# Altium schematic sheet Struct.SchDoc
size 420 x 297 mm; DocumentNumber: АБВГ.123456.XXX Э3; SheetNumber: 1; SheetTotal: 4; Title1str: УМС ЭЗАН; PageSetup: Record=PageOptionsZCenterHorizontal=FalseZCenterVertical=FalseZPrintScale=0.95ZXCorrection=0.00ZYCorrection=0.00ZPrintKind=1ZBorderSize=5000000ZLeftOffset=0ZBottomOffset=0ZOrientation=1ZPaperLength=1000ZPaperWidth=1000ZScale=100ZPaperSource=15ZPrintQuality=600ZMediaType=1ZDitherType=10ZPaperKind=A4ZPrintScaleMode=1; Title2str: (унифицированный модуль связи); Letter1Column: Р; DocumentType1str: Схема электрическая; DocumentType2str: принципиальная; DocumentCode: АБВГ.123456.XXX Э3
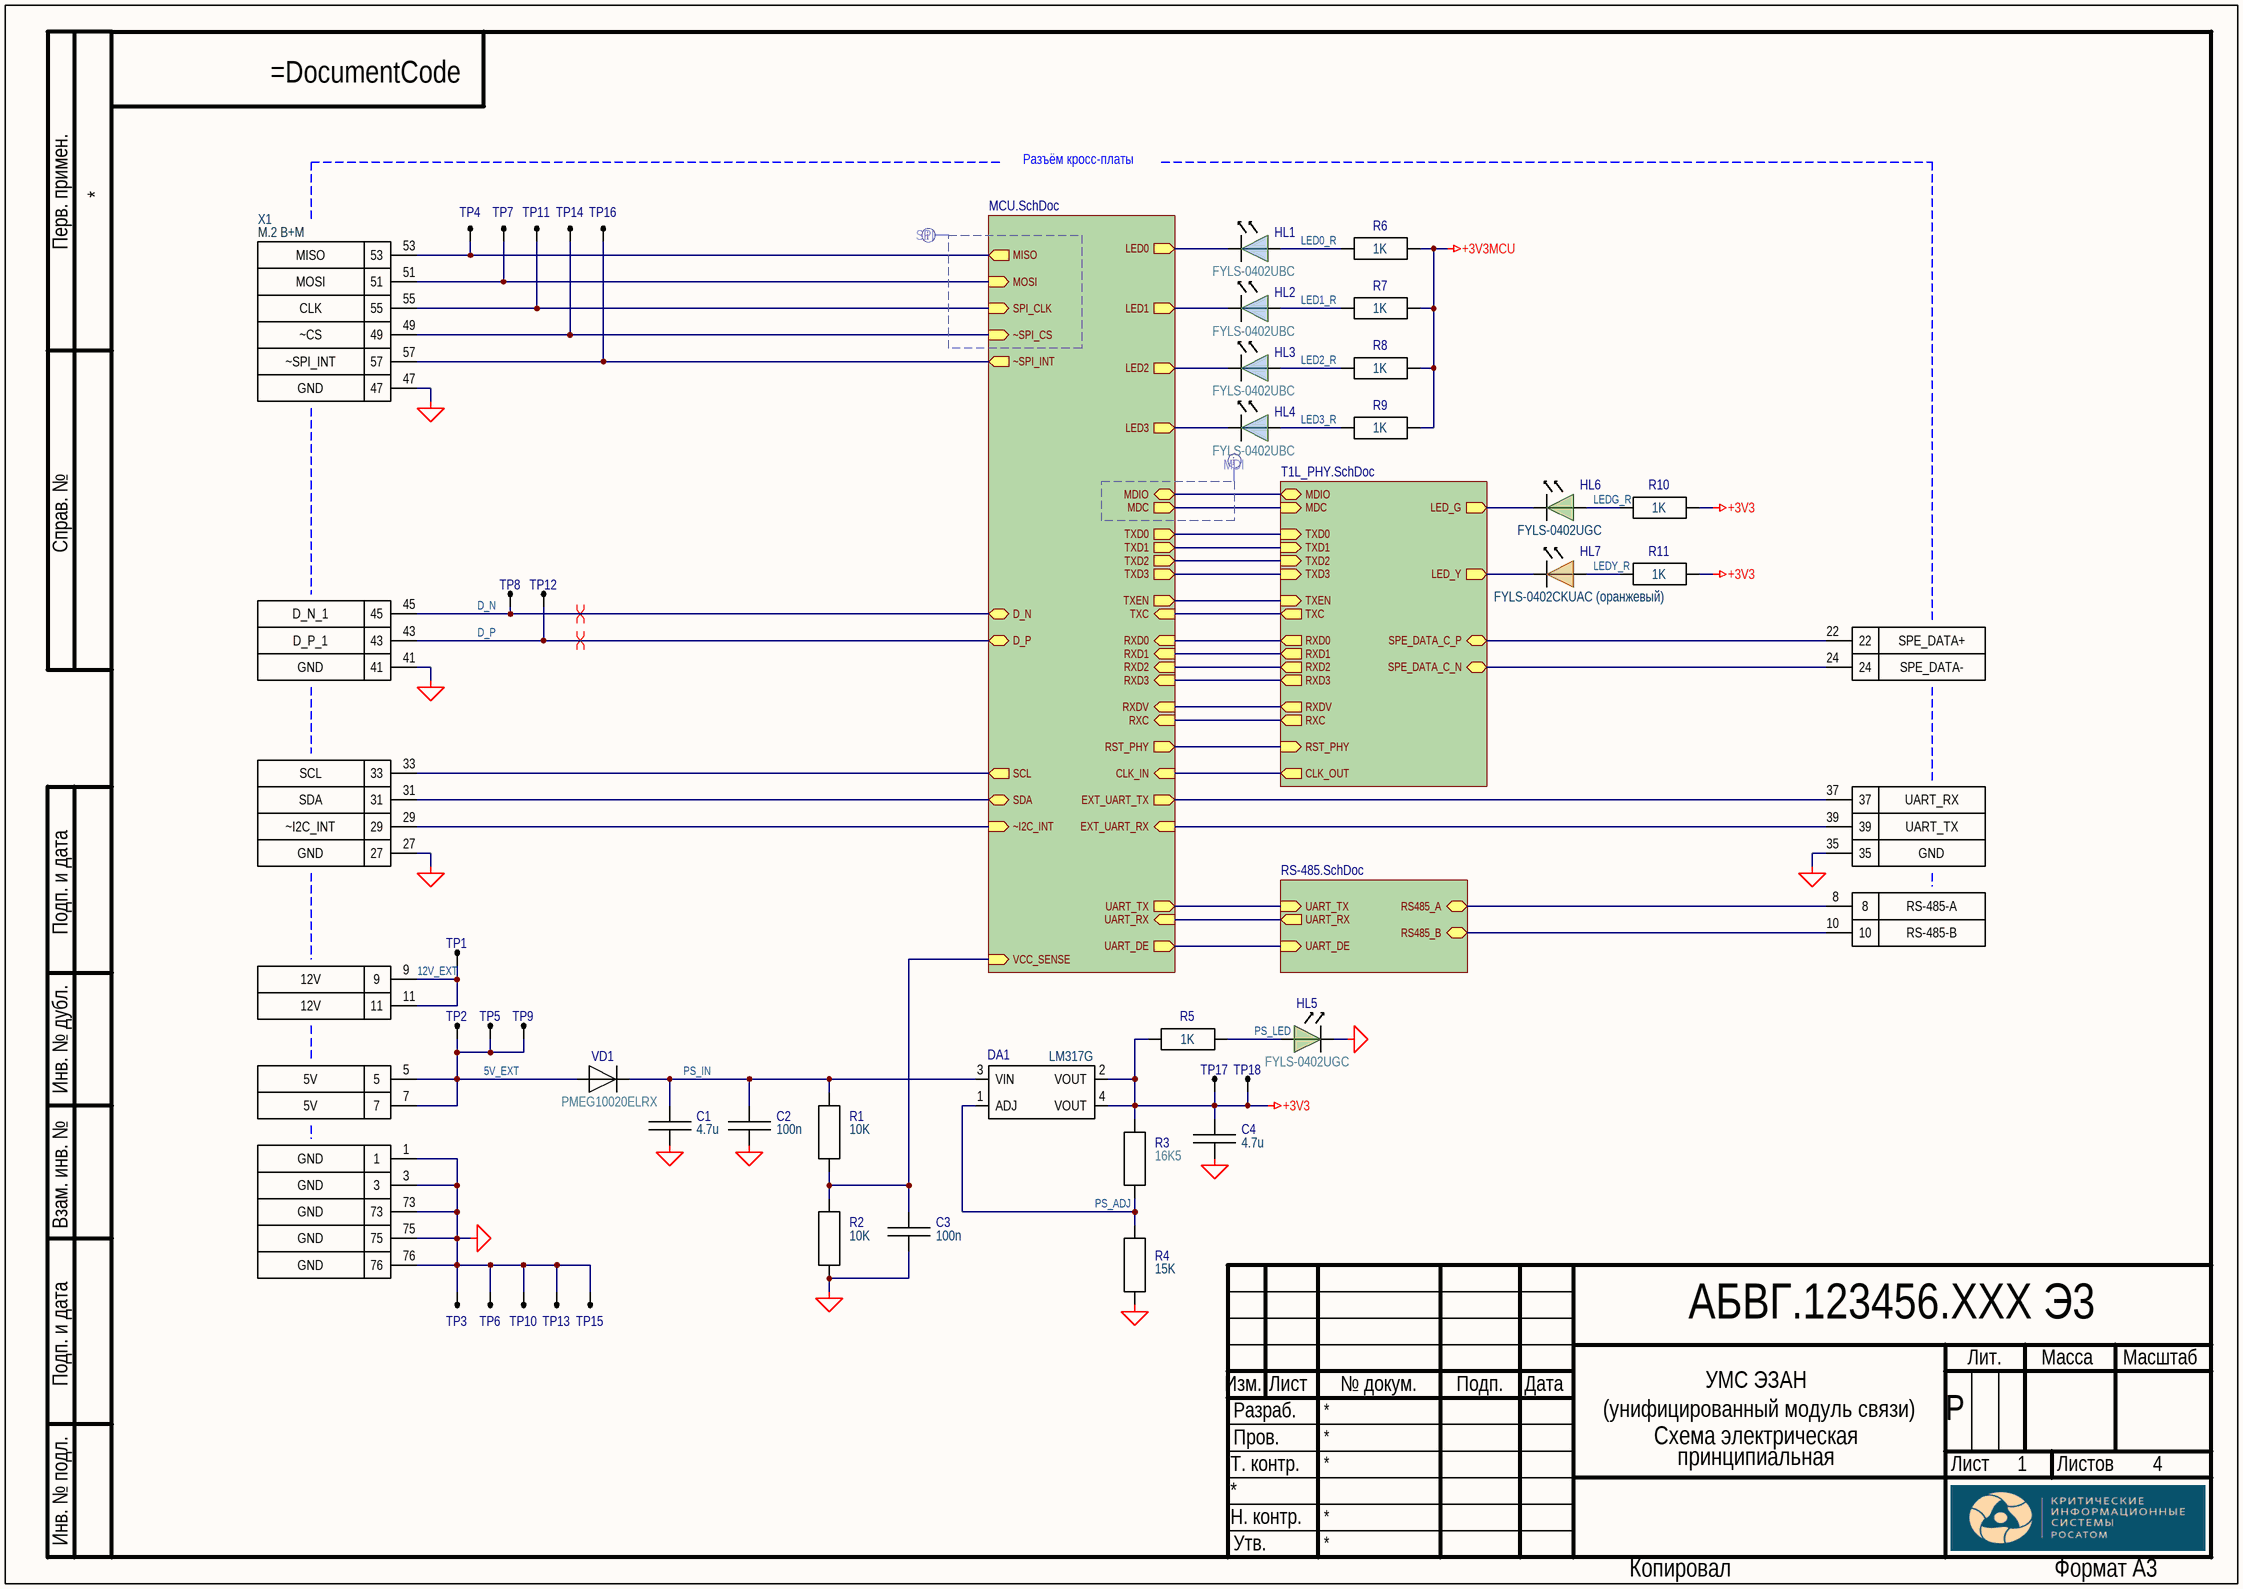
[diagram p0: Struct.SchDoc]

## Parts
C1  4.7u  [C0603]
C2  100n  [C0402]
C3  100n  [C0402]
C4  4.7u  [C0603]
DA1  LM317G  [SOT-223]
HL1  FYLS-0402UBC  [LED_SMD_0402_blue]
HL2  FYLS-0402UBC  [LED_SMD_0402_blue]
HL3  FYLS-0402UBC  [LED_SMD_0402_blue]
HL4  FYLS-0402UBC  [LED_SMD_0402_blue]
HL5  FYLS-0402UGC  [LED_SMD_0402]
HL6  FYLS-0402UGC  [LED_SMD_0402]
HL7  FYLS-0402CKUAC (оранжевый)  [LED_SMD_0402_orange]
R1  10K  [R0402]
R2  10K  [R0402]
R3  16K5  [R0603]
R4  15K  [R0603]
R5  1K  [R0402]
R6  1K  [R0402]
R7  1K  [R0402]
R8  1K  [R0402]
R9  1K  [R0402]
R10  1K  [R0402]
R11  1K  [R0402]
TP1  TEST_POINT_SMD  [TEST_POINT_SMD]  (value not drawn)  (no BOM)
TP2  TEST_POINT_SMD  [TEST_POINT_SMD]  (value not drawn)  (no BOM)
TP3  TEST_POINT_1.27_STEP  [TEST_POINT_1.27_STEP]  (value not drawn)  (no BOM)
TP4  TEST_POINT_1.27_STEP  [TEST_POINT_1.27_STEP]  (value not drawn)  (no BOM)
TP5  TEST_POINT_1.27_STEP  [TEST_POINT_1.27_STEP]  (value not drawn)  (no BOM)
TP6  TEST_POINT_1.27_STEP  [TEST_POINT_1.27_STEP]  (value not drawn)  (no BOM)
TP7  TEST_POINT_1.27_STEP  [TEST_POINT_1.27_STEP]  (value not drawn)  (no BOM)
TP8  TEST_POINT_1.27_STEP  [TEST_POINT_1.27_STEP]  (value not drawn)  (no BOM)
TP9  TEST_POINT_1.27_STEP  [TEST_POINT_1.27_STEP]  (value not drawn)  (no BOM)
TP10  TEST_POINT_SMD  [TEST_POINT_SMD]  (value not drawn)  (no BOM)
TP11  TEST_POINT_1.27_STEP  [TEST_POINT_1.27_STEP]  (value not drawn)  (no BOM)
TP12  TEST_POINT_1.27_STEP  [TEST_POINT_1.27_STEP]  (value not drawn)  (no BOM)
TP13  TEST_POINT_1.27_STEP  [TEST_POINT_1.27_STEP]  (value not drawn)  (no BOM)
TP14  TEST_POINT_1.27_STEP  [TEST_POINT_1.27_STEP]  (value not drawn)  (no BOM)
TP15  TEST_POINT_1.27_STEP  [TEST_POINT_1.27_STEP]  (value not drawn)  (no BOM)
TP16  TEST_POINT_1.27_STEP  [TEST_POINT_1.27_STEP]  (value not drawn)  (no BOM)
TP17  TEST_POINT_1.27_STEP  [TEST_POINT_1.27_STEP]  (value not drawn)  (no BOM)
TP18  TEST_POINT_1.27_STEP  [TEST_POINT_1.27_STEP]  (value not drawn)  (no BOM)
VD1  PMEG10020ELRX  [SOD123W]
X1  M2_3030_M_Partial  [m2-3030-B+M]  (value not drawn)  (parts A,B,C,D,E,F,G,H,I,J,K,L,M,N,O,P,Q,R,S,T,U,V,W,X,Y,Z,27,28,29 of 29)

## Sub-sheets
MCU = MCU.SchDoc: VCC_SENSE (in), MDIO (bidir), MDC (out), RST_PHY (out), TXEN (out), TXC (in), RXDV (in), RXC (in), RXD0 (in), RXD1 (in), RXD2 (in), RXD3 (in), TXD0 (out), TXD1 (out), TXD2 (out), TXD3 (out), LED0 (out), LED3 (out), UART_TX (out), UART_RX (in), UART_DE (out), MISO (out), MOSI (in), SPI_CLK (in), ~SPI_CS (in), ~SPI_INT (out), D_N (bidir), D_P (bidir), LED1 (out), LED2 (out), CLK_IN (in), EXT_UART_TX (out), EXT_UART_RX (in), SDA (bidir), SCL (out), ~I2C_INT (in)
RS-485 = RS-485.SchDoc: RS485_A (bidir), RS485_B (bidir), UART_TX (in), UART_RX (out), UART_DE (in)
T1L = T1L_PHY.SchDoc: RST_PHY (in), LED_G (out), LED_Y (out), MDIO (bidir), MDC (in), TXEN (in), TXC (out), RXDV (out), RXC (out), SPE_DATA_C_P (bidir), SPE_DATA_C_N (bidir), RXD0 (out), RXD1 (out), RXD2 (out), RXD3 (out), TXD0 (in), TXD1 (in), TXD2 (in), TXD3 (in), CLK_OUT (out)

## Nets
+3V3: C4.1 DA1.2(VOUT) DA1.4(VOUT) R3.2 R5.1 R10.2 R11.2 TP17.1 TP18.1
+3V3MCU: R6.2 R7.2 R8.2 R9.2
GND: C1.2 C2.1 C3.1 C4.2 HL5.2 R2.1 R4.1 TP3.1 TP6.1 TP10.1 TP13.1 TP15.1 X1.1 X1.3 X1.27 X1.35 X1.41 X1.47 X1.73 X1.75 X1.76
5V_EXT: TP2.1 TP5.1 TP9.1 VD1.2 X1.5 X1.7
12V_EXT: TP1.1 X1.9 X1.11
D_N: TP8.1 X1.45 ; sheet MCU/D_N
D_P: TP12.1 X1.43 ; sheet MCU/D_P
LED0_R: HL1.1 R6.1
LED1_R: HL2.1 R7.1
LED2_R: HL3.1 R8.1
LED3_R: HL4.1 R9.1
LEDG_R: HL6.1 R10.1
LEDY_R: HL7.1 R11.1
PS_ADJ: DA1.1(ADJ) R3.1 R4.2
PS_IN: C1.1 C2.2 DA1.3(VIN) R1.2 VD1.1
PS_LED: HL5.1 R5.2
NetC3_2: C3.2 R1.1 R2.2 ; sheet MCU/VCC_SENSE
NetHL1_2: HL1.2 ; sheet MCU/LED0
NetHL2_2: HL2.2 ; sheet MCU/LED1
NetHL3_2: HL3.2 ; sheet MCU/LED2
NetHL4_2: HL4.2 ; sheet MCU/LED3
NetHL6_2: HL6.2 ; sheet T1L/LED_G
NetHL7_2: HL7.2 ; sheet T1L/LED_Y
NetTP4_1: TP4.1 X1.53 ; sheet MCU/MISO
NetTP7_1: TP7.1 X1.51 ; sheet MCU/MOSI
NetTP11_1: TP11.1 X1.55 ; sheet MCU/SPI_CLK
NetTP14_1: TP14.1 X1.49 ; sheet MCU/~SPI_CS
NetTP16_1: TP16.1 X1.57 ; sheet MCU/~SPI_INT
NetX1_8: X1.8 ; sheet RS-485/RS485_A
NetX1_10: X1.10 ; sheet RS-485/RS485_B
NetX1_22: X1.22 ; sheet T1L/SPE_DATA_C_P
NetX1_24: X1.24 ; sheet T1L/SPE_DATA_C_N
NetX1_29: X1.29 ; sheet MCU/~I2C_INT
NetX1_31: X1.31 ; sheet MCU/SDA
NetX1_33: X1.33 ; sheet MCU/SCL
NetX1_37: X1.37 ; sheet MCU/EXT_UART_TX
NetX1_39: X1.39 ; sheet MCU/EXT_UART_RX
(unnamed): sheet T1L/RST_PHY, sheet MCU/RST_PHY
(unnamed): sheet T1L/MDIO, sheet MCU/MDIO
(unnamed): sheet T1L/MDC, sheet MCU/MDC
(unnamed): sheet T1L/TXEN, sheet MCU/TXEN
(unnamed): sheet T1L/TXC, sheet MCU/TXC
(unnamed): sheet T1L/RXDV, sheet MCU/RXDV
(unnamed): sheet T1L/RXC, sheet MCU/RXC
(unnamed): sheet T1L/RXD0, sheet MCU/RXD0
(unnamed): sheet T1L/RXD1, sheet MCU/RXD1
(unnamed): sheet T1L/RXD2, sheet MCU/RXD2
(unnamed): sheet T1L/RXD3, sheet MCU/RXD3
(unnamed): sheet T1L/TXD0, sheet MCU/TXD0
(unnamed): sheet T1L/TXD1, sheet MCU/TXD1
(unnamed): sheet T1L/TXD2, sheet MCU/TXD2
(unnamed): sheet T1L/TXD3, sheet MCU/TXD3
(unnamed): sheet T1L/CLK_OUT, sheet MCU/CLK_IN
(unnamed): sheet RS-485/UART_TX, sheet MCU/UART_TX
(unnamed): sheet RS-485/UART_RX, sheet MCU/UART_RX
(unnamed): sheet RS-485/UART_DE, sheet MCU/UART_DE

## Layout directives
differential pair: D_N, D_P
net class SPI: (no net found under the mark)
net class MDI: (no net found under the mark)

## Notes on the sheet
- Разъём кросс-платы
- X1
- M.2 B+M
- Labels drawn without touching a wire or pin: =DocumentCode
- Перв. примен.
- Справ. №
- Подп. и дата
- Инв. № дубл.
- Взам. инв. №
- Изм.
- Лист
- № докум.
- Подп.
- Дата
- Лит.
- Масса
- Масштаб
- Т. контр.
- Пров.
- Разраб.
- Листов
- Инв. № подл.
- Н. контр.
- Утв.
- Копировал
- Формат А3
- (in symbol M2_3030_B+M_Partial, part A) GND
- (in symbol M2_3030_B+M_Partial, part B) RS-485-B
- (in symbol M2_3030_B+M_Partial, part C) GND
- (in symbol M2_3030_B+M_Partial, part D) RS-485-A
- (in symbol M2_3030_B+M_Partial, part E) 5V
- (in symbol M2_3030_B+M_Partial, part F) 5V
- (in symbol M2_3030_B+M_Partial, part G) 12V
- (in symbol M2_3030_B+M_Partial, part H) 12V
- (in symbol M2_3030_B+M_Partial, part I) SPE_DATA+
- (in symbol M2_3030_B+M_Partial, part J) SPE_DATA-
- (in symbol M2_3030_B+M_Partial, part K) GND
- (in symbol M2_3030_B+M_Partial, part L) D_P_1
- (in symbol M2_3030_B+M_Partial, part M) D_N_1
- (in symbol M2_3030_B+M_Partial, part N) GND
- (in symbol M2_3030_B+M_Partial, part O) ~CS
- (in symbol M2_3030_B+M_Partial, part P) MOSI
- (in symbol M2_3030_B+M_Partial, part Q) MISO
- (in symbol M2_3030_B+M_Partial, part R) ~SPI_INT
- (in symbol M2_3030_B+M_Partial, part S) GND
- (in symbol M2_3030_B+M_Partial, part T) GND
- (in symbol M2_3030_B+M_Partial, part U) CLK
- (in symbol M2_3030_B+M_Partial, part V) GND
- (in symbol M2_3030_B+M_Partial, part W) UART_TX
- (in symbol M2_3030_B+M_Partial, part X) UART_RX
- (in symbol M2_3030_B+M_Partial, part Y) GND
- (in symbol M2_3030_B+M_Partial, part Z) SCL
- (in symbol M2_3030_B+M_Partial, part 27) SDA
- (in symbol M2_3030_B+M_Partial, part 28) ~I2C_INT
- (in symbol M2_3030_B+M_Partial, part 29) GND

## Library data of the parts
C1 C4 = C0603: Чип-конденсатор 4,7 мкФ 10% 16 В X5R 0603; Manufacturer Part Number: CC0603KRX5R7BB475; Manufacturer: Yageo; TYPE: Чип-конденсатор 0603; Value: 4,7 мкФ 10% 16 В X5R; Component Type: Конденсатор
C2 C3 = C0402: Чип-конденсатор 100 нФ 10% 50 В X7R 0402; Manufacturer Part Number: CC0402KRX7R9BB104; Manufacturer: Yageo; Value: 100 нФ 10% 50 В X7R; Component Type: Конденсатор
DA1 = LM317G: LDO-регулятор SOT-223; Manufacturer: UMW; Manufacturer Part Number: LM317G; Component Type: Микросхема
HL1-HL4 = FYLS-0402UBC: Светодиод SMD 0402 прямой синий FYLS-0402UBC; Manufacturer: Foryard; Part Number: FYLS-0402UBC; Component Type: Светодиод; Manufacturer Part Number: FYLS-0402UBC
HL5 HL6 = FYLS-0402UGC: Светодиод SMD 0402 прямой зелёный FYLS-0402UGC; Manufacturer: Foryard; Manufacturer Part Number: FYLS-0402UGC; Component Type: Светодиод
HL7 = FYLS-0402CKUAC: Светодиод SMD 0402 прямой оранжевый 0402; Manufacturer: Foryard; Manufacturer Part Number: FYLS-0402CKUAC; Component Type: Светодиод
R1 R2 = R0402_1: Чип-резистор 10 кОм 1% 0402; Manufacturer Part Number: RC0402FR-0710KL; Manufacturer: Yageo; Value: 10 кОм 1%; Component Type: Резистор
R3 = R0603_3: Чип-резистор 16,5 кОм 1% 0603; Manufacturer Part Number: RC0603FR-0716K5L; Manufacturer: Yageo; TYPE: Чип-резистор 0603; Value: 16,5 кОм 1%; Component Type: Резистор
R4 = R0603_23: Чип-резистор 15 кОм 1% 0603; Manufacturer Part Number: RC0603FR-0715KL; Manufacturer: Yageo; TYPE: Чип-резистор 0603; Value: 15 кОм 1%; Component Type: Резистор
R5-R11 = R0402_4: Чип-резистор 1 кОм 1% 0402; Manufacturer Part Number: RC0402FR-071KL; Manufacturer: Yageo; Value: 1 кОм 1%; Component Type: Резистор
TP1 TP2 TP10 = TEST_POINT_SMD: Контрольная точка SMD
TP3-TP9 TP11-TP18 = TEST_POINT_1.27_STEP: Контрольная точка SMD
VD1 = PMEG10020ELRX: Диод Шоттки SOD123W; Manufacturer: Nexperia; Manufacturer Part Number: PMEG10020ELRX; Component Type: Диод
X1 = M2_3030_B+M_Partial: Parameter 1: *